# EAGLE design LogicBoard (EAGLE 6.6.0)
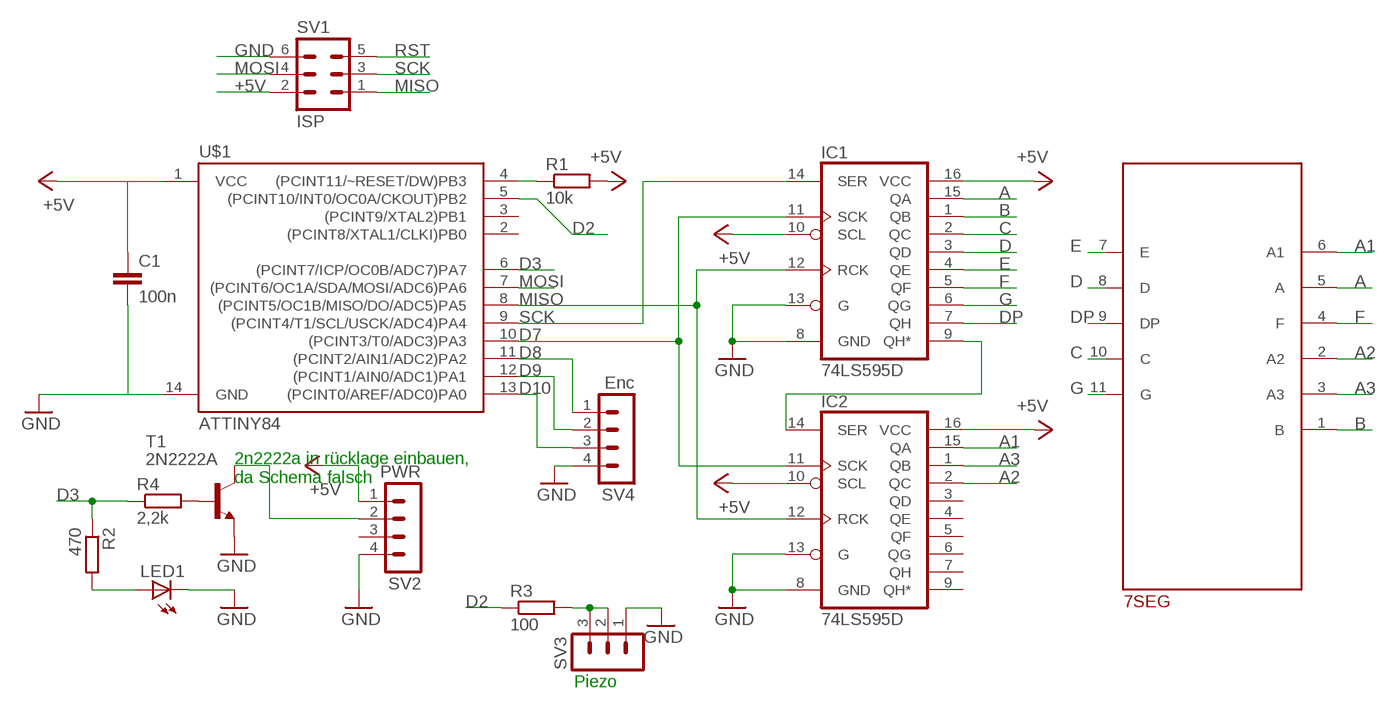
[diagram p0: schematic, sheet 1]

## Parts
7SEG  TOT4301TOT-4301FG1  [TOT4301]
C1  100n  C-EUC0805  [C0805]
IC1  74LS595D  [SO16]
IC2  74LS595D  [SO16]
LED1  LED5MM  [LED5MM]
R1  10k  R-EU_M0805  [M0805]
R2  470  R-EU_M0805  [M0805]
R3  100  R-EU_M0805  [M0805]
R4  2,2k  R-EU_M0805  [M0805]
SV1  ISP  MA03-2  [MA03-2]
SV2  PWR  MA04-1  [MA04-1]
SV3  MA03-1  [MA03-1]
SV4  Enc  MA04-1  [MA04-1]
T1  2N2222A  -NPN-SOT23-EBC  [SOT23-EBC]
U$1  ATTINY84  [SO14]

## Nets
+5V: C1.1 IC1.10(SCL) IC1.16(VCC) IC2.10(SCL) IC2.16(VCC) R1.2 SV1.2 SV2.1 U$1.1(VCC)
A: 7SEG.5(A) IC1.15(QA)
A1: 7SEG.6(A1) IC2.15(QA)
A2: 7SEG.2(A2) IC2.2(QC)
A3: 7SEG.3(A3) IC2.1(QB)
B: 7SEG.1(B) IC1.1(QB)
C: 7SEG.10(C) IC1.2(QC)
D: 7SEG.8(D) IC1.3(QD)
D2: R3.1 U$1.5((PCINT10/INT0/OC0A/CKOUT)PB2)
D3: R2.1 R4.1 U$1.6((PCINT7/ICP/OC0B/ADC7)PA7)
D7: IC1.11(SCK) IC2.11(SCK) U$1.10((PCINT3/T0/ADC3)PA3)
D8: SV4.1 U$1.11((PCINT2/AIN1/ADC2)PA2)
D9: SV4.2 U$1.12((PCINT1/AIN0/ADC1)PA1)
D10: SV4.3 U$1.13((PCINT0/AREF/ADC0)PA0)
DP: 7SEG.9(DP) IC1.7(QH)
E: 7SEG.7(E) IC1.4(QE)
F: 7SEG.4(F) IC1.5(QF)
G: 7SEG.11(G) IC1.6(QG)
GND: C1.2 IC1.8(GND) IC1.13(G) IC2.8(GND) IC2.13(G) LED1.K(C) SV1.6 SV2.4 SV3.1 SV4.4 T1.E U$1.14(GND)
MISO: IC1.12(RCK) IC2.12(RCK) SV1.1 U$1.8((PCINT5/OC1B/MISO/DO/ADC5)PA5)
MOSI: SV1.4 U$1.7((PCINT6/OC1A/SDA/MOSI/ADC6)PA6)
N$1: LED1.A R2.2
N$2: R3.2 SV3.2 SV3.3
N$3: R4.2 T1.B
N$5: SV2.2 T1.C
OE: IC1.9(QH*) IC2.14(SER)
RST: R1.1 SV1.5 U$1.4((PCINT11/~RESET/DW)PB3)
SCK: IC1.14(SER) SV1.3 U$1.9((PCINT4/T1/SCL/USCK/ADC4)PA4)
Unconnected: IC2.3(QD) IC2.4(QE) IC2.5(QF) IC2.6(QG) IC2.7(QH) IC2.9(QH*) SV2.3 U$1.2((PCINT8/XTAL1/CLKI)PB0) U$1.3((PCINT9/XTAL2)PB1)

## Notes on the sheet
- 2n2222a in rücklage einbauen, 
  da Schema falsch
- Piezo

## Library data of the parts
7SEG = TOT4301_lib:TOT4301
C1 = rcl:C-EU: CAPACITOR, European symbol
IC1 IC2 = SparkFun-DigitalIC:74*595: 8-bit SHIFT REGISTER, output latch; PROD_ID: IC-07875
LED1 = led:LED: LED OSRAM: - CHIPLED LG R971, LG N971, LY N971, LG Q971, LY Q971, LO R971, LY R971 LH N974, LH R974 LS Q976, LO Q976, LY Q976 LO Q996 - Hyper CHIPLED LW Q18S LB Q993, LB Q99A, LB R99A - SideLED LS A670, LO A670, LY A670, LG A670, LP A670 LB A673, LV A673, LT A673, LW A673 LH A674 LY A675 LS A676, LA A676, LO A676, LY A676, LW A676 LS A679, LY A679, LG A679 - Hyper Micro SIDELED® LS Y876, LA Y876, LO Y876, LY Y876 LT Y87S - SmartLED LW L88C, LW L88S LB L89C, LB L89S, LG L890 LS L89K, LO L89K, LY L89K LS L896, LA L896, LO L896, LY L896 - TOPLED LS T670, LO T670, LY T670, LG T670, LP T670 LSG T670, LSP T670, LSY T670, LOP T670, LYG T670 LG T671, LOG T671, LSG T671 LB T673, LV T673, LT T673, LW T673 LH T674 LS T676, LA T676, LO T676, LY T676, LB T676, LH T676, LSB T676, LW T676 LB T67C, LV T67C, LT T67C, LS T67K, LO T67K, LY T67K, LW E67C LS E67B, LA E67B, LO E67B, LY E67B, LB E67C, LV E67C, LT E67C LW T67C LS T679, LY T679, LG T679 LS T770, LO T770, LY T770, LG T770, LP T770 LB T773, LV T773, LT T773, LW T773 LH T774 LS E675, LA E675, LY E675, LS T675 LS T776, LA T776, LO T776, LY T776, LB T776 LHGB T686 LT T68C, LB T68C - Hyper Mini TOPLED® LB M676 - Mini TOPLED Santana® LG M470 LS M47K, LO M47K, LY M47K Source: http://www.osram.convergy.de LUXEON: - LUMILED® LXK2-PW12-R00, LXK2-PW12-S00, LXK2-PW14-U00, LXK2-PW14-V00 LXK2-PM12-R00, LXK2-PM12-S00, LXK2-PM14-U00 LXK2-PE12-Q00, LXK2-PE12-R00, LXK2-PE12-S00, LXK2-PE14-T00, LXK2-PE14-U00 LXK2-PB12-K00, LXK2-PB12-L00, LXK2-PB12-M00, LXK2-PB14-N00, LXK2-PB14-P00, LXK2-PB14-Q00 LXK2-PR12-L00, LXK2-PR12-M00, LXK2-PR14-Q00, LXK2-PR14-R00 LXK2-PD12-Q00, LXK2-PD12-R00, LXK2-PD12-S00 LXK2-PH12-R00, LXK2-PH12-S00 LXK2-PL12-P00, LXK2-PL12-Q00, LXK2-PL12-R00 Source: www.luxeon.com KINGBRIGHT: KA-3528ASYC Source: www.kingbright.com
R1-R4 = rcl:R-EU_: RESISTOR, European symbol
SV1 = con-lstb:MA03-2: PIN HEADER; OC_FARNELL: unknown; OC_NEWARK: unknown
SV2 SV4 = con-lstb:MA04-1: PIN HEADER; OC_FARNELL: unknown; OC_NEWARK: unknown
SV3 = con-lstb:MA03-1: PIN HEADER; OC_FARNELL: unknown; OC_NEWARK: unknown
T1 = transistor:*-NPN-: NPN Transistror BF959 corrected 2008.03.06
U$1 = SparkFun-DigitalIC:ATTINY84: Atmel 14-pin 2/4/8kB flash uC; PROD_ID: IC-11285

## Board
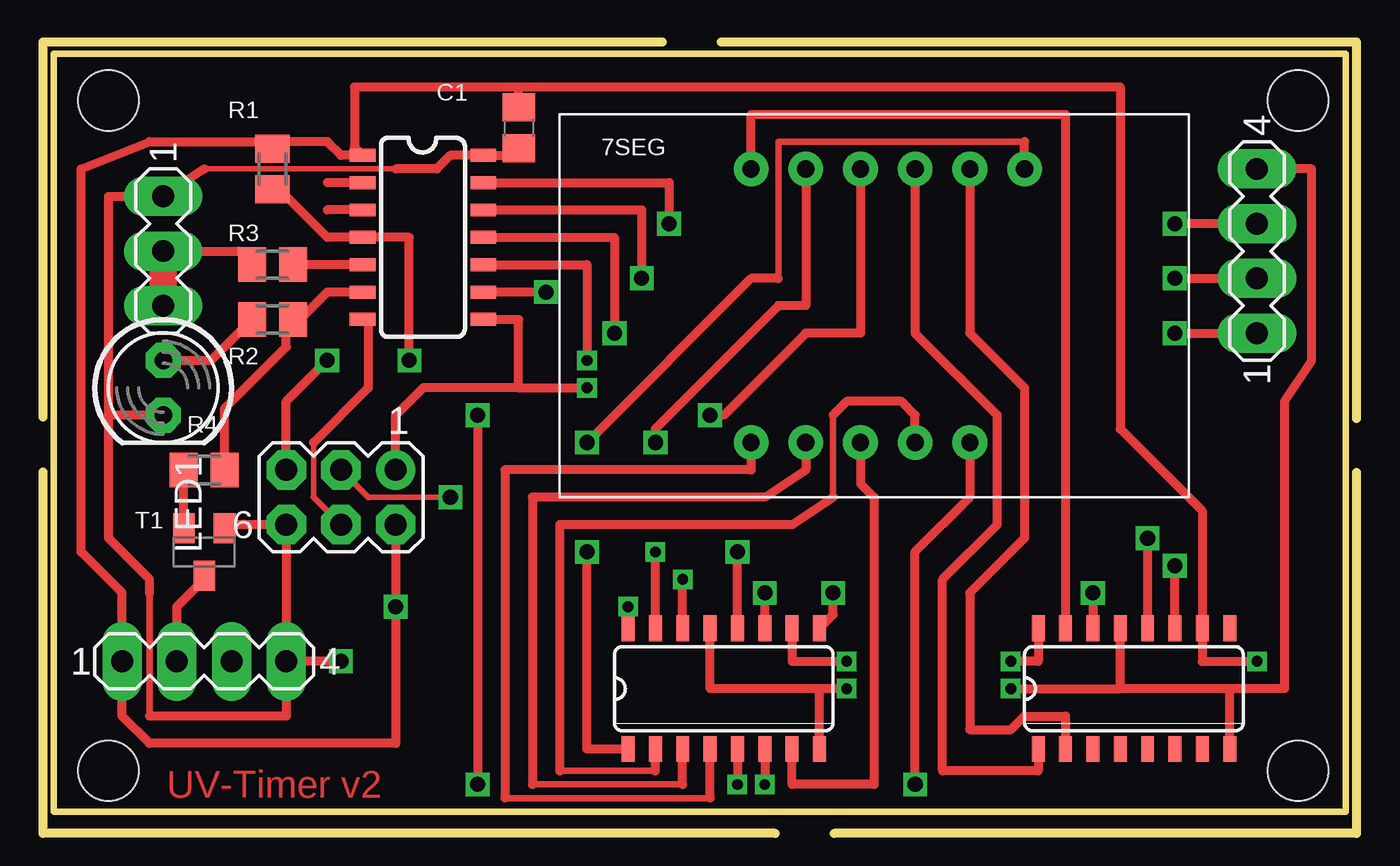
[diagram p1: board, top side]
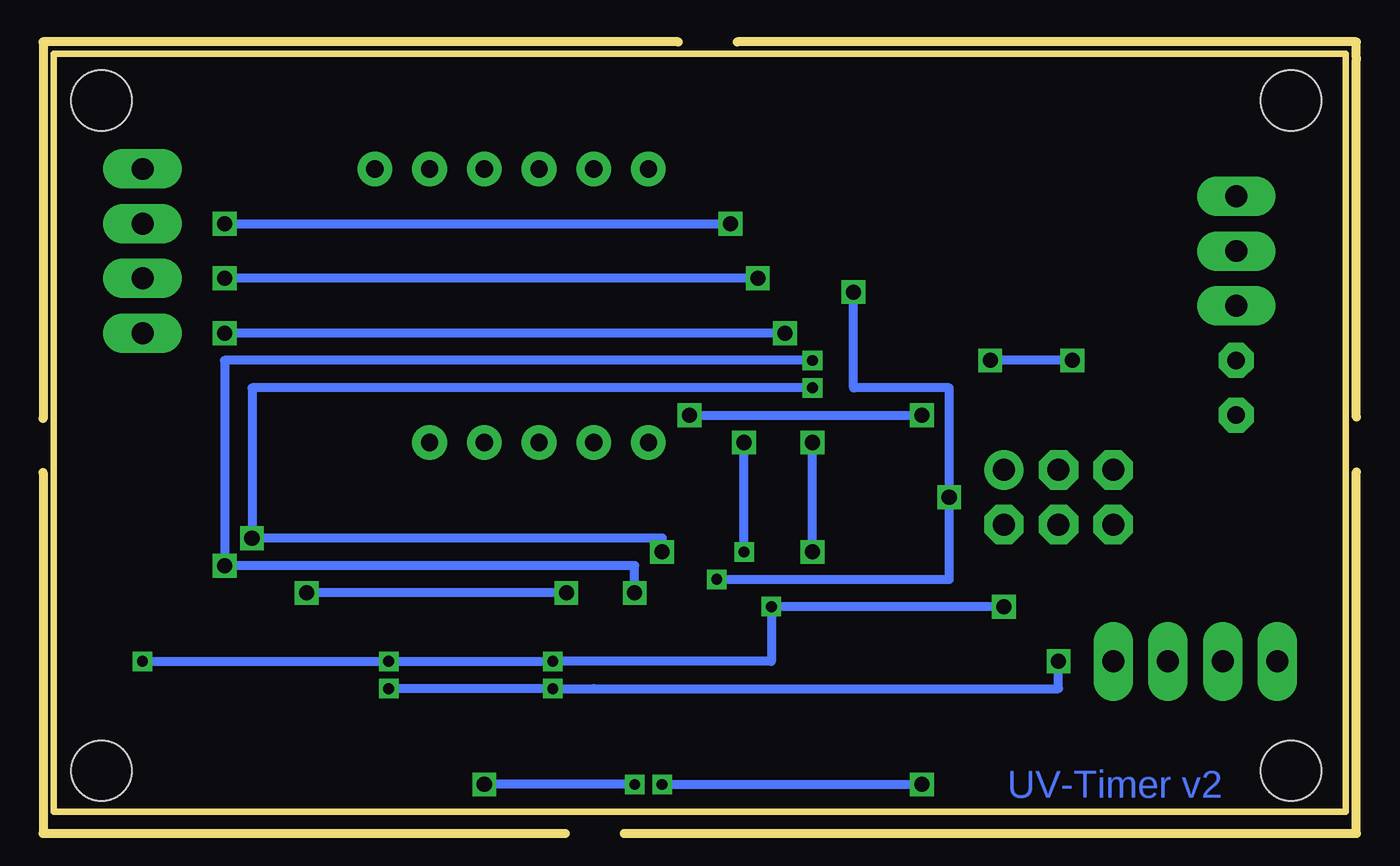
[diagram p2: board, bottom side, seen from below]

Size 60 x 35.19 mm. Coordinates in mm from the lower left corner, seen from the top.
Outline: 0,0 60,0 60,35.19 0,35.19 0,0
Copper layers (1*16): Top 0.035mm / dielectric 1.5mm / Bottom 0.035mm
Design rules "default *": minimum track width 10mil, minimum drill 20mil, track to track 10mil, track to pad 12mil, pad to pad 12mil, via to via 12mil, smd to smd 12mil, copper to edge 20mil, drill to drill 8mil, minimum pad ring 16mil, minimum via ring 8mil, stop-mask expansion 4mil, vias tented up to drill 0mil, thermal gap 16mil
Holes 2.8 mm at 2.54,1.9 2.54,33.02 57.78,1.9 57.78,33.02
Milling: 9 lines

### Footprints (pad centres in the part's own frame; a part is rotated, then mirrored left to right if it is on the bottom)
TOT4301 = drill 0.8: 1 6.35,5.08; 2 3.81,5.08; 3 1.27,5.08; 4 -1.27,5.08; 5 -3.81,5.08; 6 -6.35,5.08; 7 -6.35,-7.62; 8 -3.81,-7.62; 9 -1.27,-7.62; 10 1.27,-7.62; 11 3.81,-7.62
C0805 = smd 1.3 x 1.5: 1 -0.95,0; 2 0.95,0
SO16 = smd 0.6 x 1.2: 1 -4.445,-2.8; 2 -3.175,-2.8; 3 -1.905,-2.8; 4 -0.635,-2.8; 5 0.635,-2.8; 6 1.905,-2.8; 7 3.175,-2.8; 8 4.445,-2.8; 9 4.445,2.8; 10 3.175,2.8; 11 1.905,2.8; 12 0.635,2.8; 13 -0.635,2.8; 14 -1.905,2.8; 15 -3.175,2.8; 16 -4.445,2.8
LED5MM = drill 0.813 octagon: A -1.27,0; K 1.27,0
M0805 = smd 1.3 x 1.6: 1 -0.95,0; 2 0.95,0
MA03-2 = drill 1.016: 1 -2.54,-1.27 | drill 1.016 octagon: 2 -2.54,1.27; 3 0,-1.27; 4 0,1.27; 5 2.54,-1.27; 6 2.54,1.27
MA04-1 = drill 1.016 long: 1 -3.81,0; 2 -1.27,0; 3 1.27,0; 4 3.81,0
MA03-1 = drill 1.016 long: 1 -2.54,0; 2 0,0; 3 2.54,0
SOT23-EBC = smd 1 x 1.4: B 0.95,-1.1; C 0,1.1; E -0.95,-1.1
SO14 = smd 0.6 x 1.2: 1 -3.81,-2.8; 2 -2.54,-2.8; 3 -1.27,-2.8; 4 0,-2.8; 5 1.27,-2.8; 6 2.54,-2.8; 7 3.81,-2.8; 8 3.81,2.8; 9 2.54,2.8; 10 1.27,2.8; 11 0,2.8; 12 -1.27,2.8; 13 -2.54,2.8; 14 -3.81,2.8

### Placement (x,y rotation side)
7SEG  38.73,24.77 0 top
C1  21.59,31.75 270 top
IC1  31.11,5.71 0 top
IC2  50.16,5.71 0 top
LED1  5.08,19.68 270 top
R1  10.16,29.84 90 top
R2  10.16,22.86 180 top
R3  10.16,25.4 180 top
R4  6.99,15.88 180 top
SV1  13.34,14.61 180 top
SV2  6.99,6.99 0 top
SV3  5.08,26.04 270 top
SV4  55.88,26.04 90 top
T1  6.99,12.06 180 top
U$1  17.14,26.67 270 top

### Tracks (layer width: path | path; a pad name or v marks a point on that pad's centre or on a via)
+5V  (via drill 0.5, 0.7)
  Top 0.406: SV1.2 v15.88,9.53 15.88,3.17 4.45,3.17 3.17,4.45 SV2.1 3.17,10.16 1.27,12.06 1.27,29.84 4.45,31.12 9.84,31.12 R1.2 | IC1.10 34.29,6.99 v36.83,6.99 | v55.88,6.99 53.34,6.99 IC2.10 53.34,13.97 49.53,17.78 49.53,33.66 21.59,33.66 | IC2.16 45.72,6.99 v44.45,6.99 | IC1.16 v26.67,9.53 | 21.59,33.66 13.97,33.66 13.97,30.86 U$1.1 | C1.1 21.59,33.66
  Bottom 0.406: v55.88,6.99 v44.45,6.99 v36.83,6.99 26.67,6.99 v26.67,9.53 v15.88,9.53
A  (via drill 0.5, 0.7)
  Top 0.406: 7SEG.5 34.92,23.5 33.66,23.5 27.94,17.78 v27.94,17.14 | IC1.15 v27.94,12.06
  Bottom 0.406: v27.94,12.06 v27.94,17.14
A1
  Top 0.406: 7SEG.6 32.38,32.38 46.99,32.38 IC2.15
A2
  Top 0.406: 7SEG.2 42.55,22.23 45.09,19.68 45.09,12.7 42.55,10.16 42.55,3.81 44.45,3.81 45.09,4.45 46.99,4.45 IC2.2
A3
  Top 0.406: 7SEG.3 40.01,22.23 43.81,18.41 43.81,13.34 41.27,10.79 41.27,1.9 45.72,1.9 IC2.1
B  (via drill 0.7)
  Top 0.305: 45.09,31.12 33.66,31.12 33.66,24.77
  Top 0.406: v24.77,12.06 24.77,2.92 IC1.1 | 7SEG.1 45.09,31.12 | 33.66,24.77 32.38,24.77 v24.77,17.14
  Bottom 0.406: v24.77,12.06 v24.77,17.14
C
  Top 0.305: 36.2,18.41 36.2,14.61 | 23.5,1.9 27.94,1.9
  Top 0.406: 36.2,14.61 34.29,13.34 23.5,13.34 23.5,1.9 | 27.94,1.9 IC1.2 | 7SEG.10 40.01,18.41 39.37,19.05 36.83,19.05 36.2,18.41
D
  Top 0.305: 22.23,1.27 29.21,1.27
  Top 0.406: 7SEG.8 34.92,15.88 33.02,14.61 22.23,14.61 22.23,1.27 | 29.21,1.27 IC1.3
D2
  Top 0.406: U$1.5 R3.1
D3
  Top 0.406: U$1.6 12.7,24.13 11.43,22.86 R2.1 10.79,22.55 10.79,21.59 7.94,18.73 R4.1
D7  (via drill 0.5, 0.7)
  Top 0.406: IC2.11 v52.07,11.43 | IC1.11 v33.02,10.16 | U$1.10 24.77,25.4 v24.77,20.95
  Bottom 0.406: v33.02,10.16 33.02,11.43 v52.07,11.43 52.07,20.95 v24.77,20.95
D8  (via drill 0.7)
  Top 0.406: U$1.11 26.04,26.67 v26.04,22.23 | v52.07,22.23 SV4.1
  Bottom 0.406: v26.04,22.23 v52.07,22.23
D9  (via drill 0.7)
  Top 0.406: U$1.12 27.3,27.94 v27.3,24.77 | v52.07,24.77 SV4.2
  Bottom 0.406: v27.3,24.77 v52.07,24.77
D10  (via drill 0.7)
  Top 0.406: U$1.13 28.57,29.21 v28.57,27.3 | SV4.3 v52.07,27.3
  Bottom 0.406: v52.07,27.3 v28.57,27.3
DP
  Top 0.406: IC1.7 34.29,1.27 38.1,1.27 38.1,14.61 37.47,15.24 7SEG.9
E
  Top 0.305: 20.95,0.64 30.48,0.64
  Top 0.406: 7SEG.7 32.38,15.88 20.95,15.88 20.95,0.64 | 30.48,0.64 IC1.4
F  (via drill 0.5, 0.7)
  Top 0.406: IC1.5 v31.75,1.27 | 7SEG.4 37.47,22.23 34.92,22.23 31.11,18.41 v30.48,18.41 | v19.68,18.41 v19.68,1.27
  Bottom 0.406: v31.75,1.27 v19.68,1.27 | v30.48,18.41 v19.68,18.41
G  (via drill 0.5, 0.7)
  Top 0.406: 7SEG.11 42.55,14.61 40.01,12.06 v40.01,1.27 | IC1.6 v33.02,1.27
  Bottom 0.406: v33.02,1.27 v40.01,1.27
GND  (via drill 0.5, 0.7)
  Top 0.254: 15.88,29.84 6.99,29.84
  Top 0.305: 4.45,4.45 4.45,10.16
  Top 0.406: IC2.8 54.61,5.71 | 54.61,5.71 49.53,5.71 | 49.53,5.71 IC2.13 | v36.83,5.71 35.56,5.71 | 35.56,5.71 30.48,5.71 IC1.13 | v44.45,5.71 49.53,5.71 | 54.61,5.71 57.15,5.71 57.15,19.05 58.42,20.95 58.42,29.84 SV4.4 | 15.88,29.84 17.78,29.84 18.41,30.48 U$1.14 21.27,30.48 C1.2 | SV2.4 SV1.6 8.11,13.34 T1.E | SV2.4 10.79,4.45 4.45,4.45 | IC1.8 35.56,5.71 | v13.34,6.99 SV2.4 | LED1.K 2.54,18.41 | 2.54,18.41 2.54,28.57 SV3.1 6.99,29.84 | 4.45,10.16 4.45,10.79 2.54,12.7 2.54,18.41
  Bottom 0.406: v36.83,5.71 34.92,5.71 | v36.83,5.71 v44.45,5.71 | v36.83,5.71 13.34,5.71 v13.34,6.99
MISO  (via drill 0.5, 0.7)
  Top 0.406: IC1.12 v31.75,12.06 | IC2.12 v50.8,12.7 | U$1.8 21.59,22.86 21.59,19.68 | 21.59,19.68 v24.77,19.68 | SV1.1 15.88,18.41 17.14,19.68 21.59,19.68
  Bottom 0.406: v31.75,12.06 31.75,12.7 v50.8,12.7 50.8,19.68 v24.77,19.68
MOSI
  Top 0.254: 12.06,17.14 12.06,14.61
  Top 0.305: 12.06,14.61 SV1.4
  Top 0.406: U$1.7 14.61,22.86 14.61,19.68 12.06,17.14
N$1
  Top 0.406: LED1.A 7.3,20.95 R2.2
N$2
  Top 0.406: SV3.2 8.57,26.04 R3.2
  Top 1.27: SV3.3 SV3.2
N$3
  Top 0.406: T1.B R4.2
N$4
  Top 0.406: 13.97,30.48 13.34,30.48 12.7,31.12 10.16,31.12
N$5
  Top 0.406: T1.C 6.99,10.79 5.71,9.53 SV2.2
N$6
  Top 0.406: 13.97,27.94 12.7,27.94
N$7
  Top 0.406: 13.97,29.21 12.7,29.21
OE  (via drill 0.7)
  Top 0.406: IC1.9 36.2,9.15 v36.2,10.16 | v48.26,10.16 IC2.14
  Bottom 0.406: v36.2,10.16 v48.26,10.16
RST  (via drill 0.7)
  Top 0.406: SV1.5 10.79,19.05 v12.7,20.95 | v16.51,20.95 16.51,26.67 U$1.4 12.7,26.67 10.79,28.57 10.48,28.57 R1.1
  Bottom 0.406: v12.7,20.95 v16.51,20.95
SCK  (via drill 0.5, 0.7)
  Top 0.254: 14.61,14.61 v18.41,14.61
  Top 0.305: SV1.3 14.61,14.61
  Top 0.406: IC1.14 v29.21,10.79 | v22.86,24.13 U$1.9
  Bottom 0.406: v29.21,10.79 18.41,10.79 v18.41,14.61 18.41,19.68 22.86,19.68 v22.86,24.13

### Text on the board
Top: UV-Timer v2
Bottom: UV-Timer v2
tStop: UV-Timer v2
bStop: UV-Timer v2